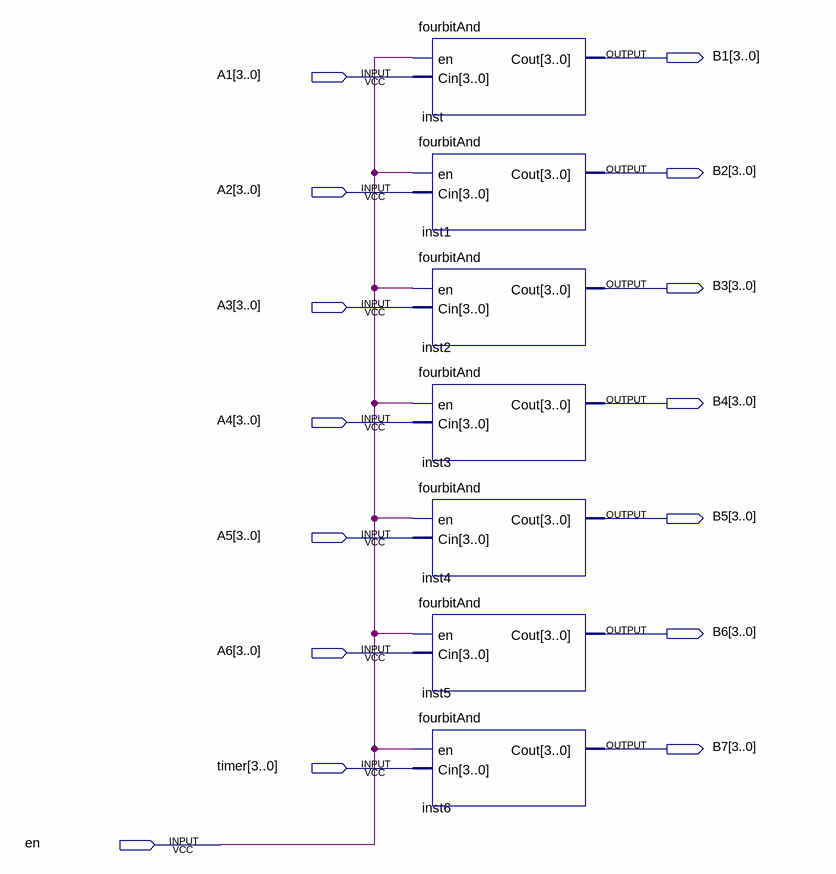
[diagram p0: schematic sheet]
// Quartus schematic sixAnd.bdf as structural Verilog: 7 symbols, 15 pins
module sixAnd (
  input  [3:0] A1,
  input  [3:0] A2,
  input  [3:0] A3,
  input  [3:0] A4,
  input  [3:0] A5,
  input  [3:0] A6,
  input  [3:0] timer,
  input  en,
  output [3:0] B1,
  output [3:0] B2,
  output [3:0] B3,
  output [3:0] B4,
  output [3:0] B5,
  output [3:0] B6,
  output [3:0] B7
);

  fourbitAnd inst (.en(en), .Cin(A1), .Cout(B1));
  fourbitAnd inst1 (.en(en), .Cin(A2), .Cout(B2));
  fourbitAnd inst2 (.en(en), .Cin(A3), .Cout(B3));
  fourbitAnd inst3 (.en(en), .Cin(A4), .Cout(B4));
  fourbitAnd inst4 (.en(en), .Cin(A5), .Cout(B5));
  fourbitAnd inst5 (.en(en), .Cin(A6), .Cout(B6));
  fourbitAnd inst6 (.en(en), .Cin(timer), .Cout(B7));
endmodule
